# Altium project flexplatV1.1.PrjPCB
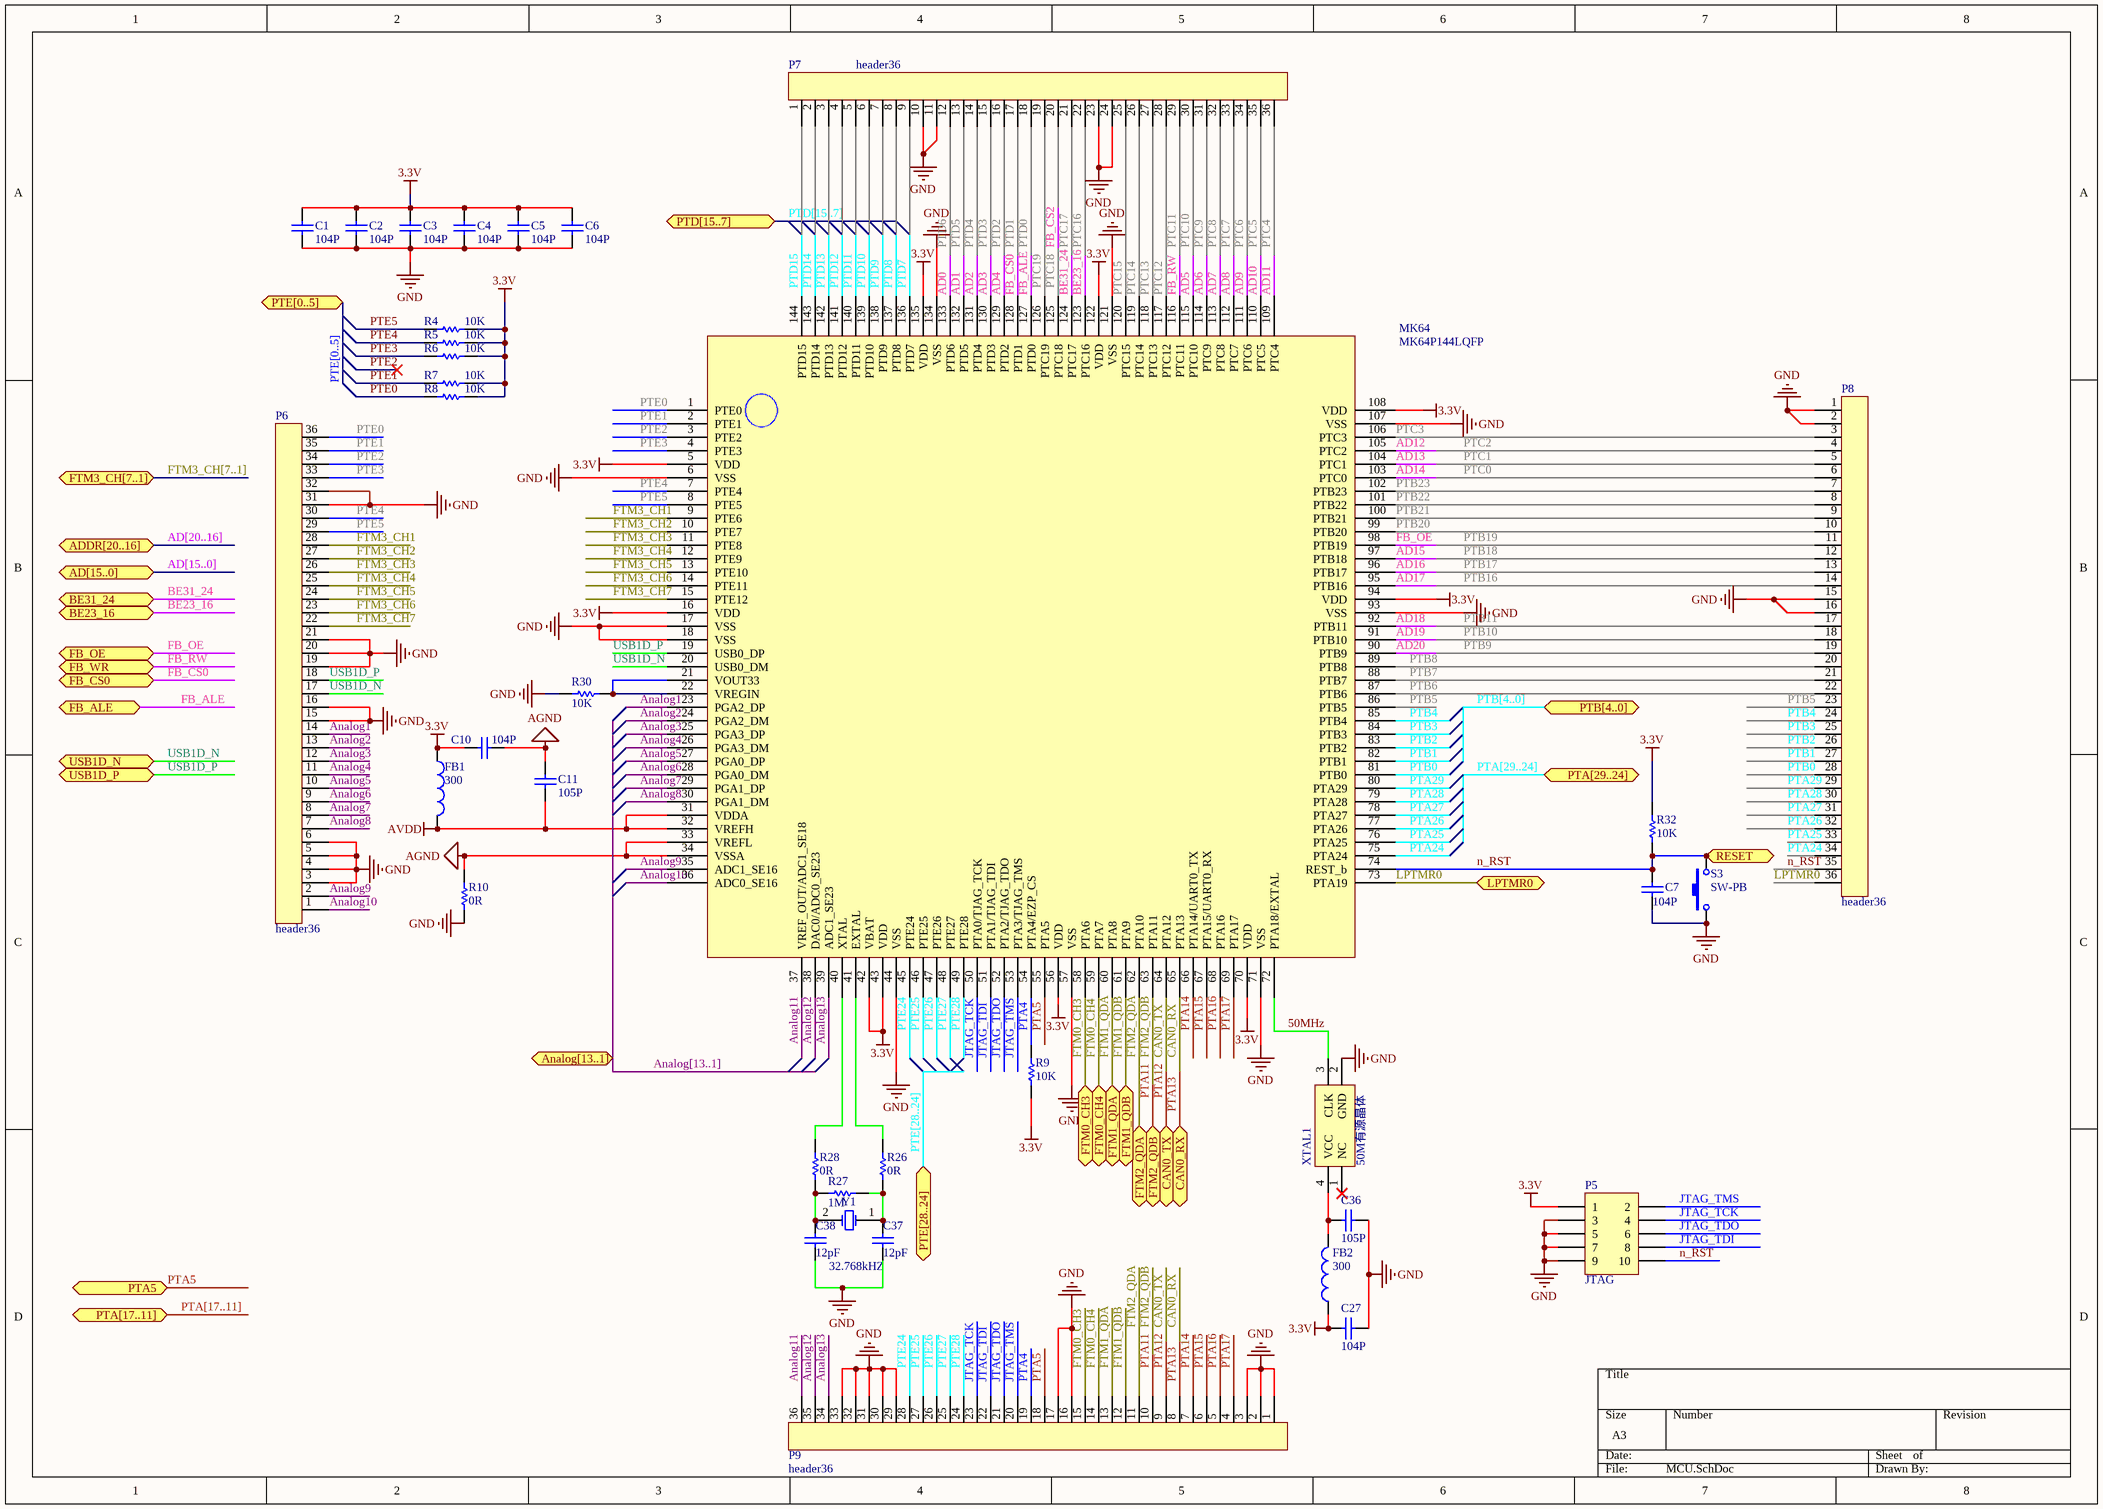
[diagram p0: MCU.SchDoc]
2 sheets, 47 parts. Net scope: flat (ports and power ports of the same name join across sheets).
Board file: FPv1.3.PcbDoc
Sheets:
  MCU.SchDoc
  connect.SchDoc

## Sheet MCU.SchDoc
size A3

### Parts
C1  value 104P  [1608[0603]]  (hidden comment: Cap)
C2  value 104P  [1608[0603]]  (hidden comment: Cap)
C3  value 104P  [1608[0603]]  (hidden comment: Cap)
C4  value 104P  [1608[0603]]  (hidden comment: Cap)
C5  value 104P  [1608[0603]]  (hidden comment: Cap)
C6  value 104P  [1608[0603]]  (hidden comment: Cap)
C7  value 104P  [1608[0603]]  (hidden comment: Cap)
C10  value 104P  [1608[0603]]  (hidden comment: Cap)
C11  value 105P  [1608[0603]]  (hidden comment: Cap)
C27  value 104P  [1608[0603]]  (hidden comment: Cap)
C36  value 105P  [1608[0603]]  (hidden comment: Cap)
C37  value 12pF  [1608[0603]]  (hidden comment: Cap)
C38  value 12pF  [1608[0603]]  (hidden comment: Cap)
FB1  value 300  [1608[0603]]  (hidden comment: Inductor)
FB2  value 300  [1608[0603]]  (hidden comment: Inductor)
MK64  MK64P144LQFP  [LQFP-144]
P5  JTAG  [MHDR2X5]
P6  header36  [FFC/SM0.5-2H36]
P7  header36  [FFC/SM0.5-2H36]
P8  header36  [FFC/SM0.5-2H36]
P9  header36  [FFC/SM0.5-2H36]
R4  value 10K  [1608[0603]]  (hidden comment: Res)
R5  value 10K  [1608[0603]]  (hidden comment: Res)
R6  value 10K  [1608[0603]]  (hidden comment: Res)
R7  value 10K  [1608[0603]]  (hidden comment: Res)
R8  value 10K  [1608[0603]]  (hidden comment: Res)
R9  value 10K  [1608[0603]]  (hidden comment: Res)
R10  value 0R  [1608[0603]]  (hidden comment: Res)
R26  value 0R  [1608[0603]]  (hidden comment: Res)
R27  value 1M  [1608[0603]]  (hidden comment: Res)
R28  value 0R  [1608[0603]]  (hidden comment: Res)
R30  value 10K  [1608[0603]]  (hidden comment: Res)
R32  value 10K  [1608[0603]]  (hidden comment: Res)
S3  SW-PB  [key 3*4*2]
XTAL1  50M有源晶体  [XTAL7_3225]
Y1  32.768kHZ  [3215]

### Ports
AD[15..0], ADDR[20..16], Analog[13..1], BE23_16, BE31_24, CAN0_RX, CAN0_TX, FB_ALE, FB_CS0, FB_OE, FB_WR, FTM0_CH3, FTM0_CH4, FTM1_QDA, FTM1_QDB, FTM2_QDA, FTM2_QDB, FTM3_CH[7..1], LPTMR0, PTA5, PTA[17..11], PTA[29..24], PTB[4..0], PTD[15..7], PTE[0..5], PTE[28..24], RESET, USB1D_N, USB1D_P

### Nets
3.3V: C1.2 C2.2 C3.2 C4.2 C5.2 C6.2 C10.1 C27.2 FB1.1 FB2.1 MK64.5(VDD) MK64.16(VDD) MK64.42(VBAT) MK64.43(VDD) MK64.56(VDD) MK64.70(VDD) MK64.94(VDD) MK64.108(VDD) MK64.122(VDD) MK64.135(VDD) P5.1 R4.1 R5.1 R6.1 R7.1 R8.1 R9.1 R32.1
AGND: C10.2 C11.2 MK64.33(VREFL) MK64.34(VSSA) R10.2
AVDD: C11.1 FB1.2 MK64.31(VDDA) MK64.32(VREFH)
GND: C1.1 C2.1 C3.1 C4.1 C5.1 C6.1 C7.1 C27.1 C36.1 C37.1 C38.1 MK64.6(VSS) MK64.17(VSS) MK64.18(VSS) MK64.44(VSS) MK64.57(VSS) MK64.71(VSS) MK64.93(VSS) MK64.107(VSS) MK64.121(VSS) MK64.134(VSS) P5.3 P5.5 P5.7 P5.9 P6.3 P6.4 P6.5 P6.6 P6.15 P6.16 P6.19 P6.20 P6.21 P6.31 P6.32 P7.10 P7.11 P7.23 P7.24 P8.1 P8.2 P8.15 P8.16 P9.1 P9.2 P9.3 P9.16 P9.17 P9.29 P9.30 P9.31 P9.32 P9.33 R10.1 R30.1 S3.1 XTAL1.2(GND)
50MHz: MK64.72(PTA18/EXTAL) XTAL1.3(CLK)
AD0: MK64.133(PTD6) P7.12  [also labelled PTD6]
AD1: MK64.132(PTD5) P7.13  [also labelled PTD5]
AD2: MK64.131(PTD4) P7.14  [also labelled PTD4]
AD3: MK64.130(PTD3) P7.15  [also labelled PTD3]
AD4: MK64.129(PTD2) P7.16  [also labelled PTD2]
AD5: MK64.115(PTC10) P7.30  [also labelled PTC10]
AD6: MK64.114(PTC9) P7.31  [also labelled PTC9]
AD7: MK64.113(PTC8) P7.32  [also labelled PTC8]
AD8: MK64.112(PTC7) P7.33  [also labelled PTC7]
AD9: MK64.111(PTC6) P7.34  [also labelled PTC6]
AD10: MK64.110(PTC5) P7.35  [also labelled PTC5]
AD11: MK64.109(PTC4) P7.36  [also labelled PTC4]
AD12: MK64.105(PTC2) P8.4  [also labelled PTC2]
AD13: MK64.104(PTC1) P8.5  [also labelled PTC1]
AD14: MK64.103(PTC0) P8.6  [also labelled PTC0]
AD15: MK64.97(PTB18) P8.12  [also labelled PTB18]
AD16: MK64.96(PTB17) P8.13  [also labelled PTB17]
AD17: MK64.95(PTB16) P8.14  [also labelled PTB16]
AD18: MK64.92(PTB11) P8.17  [also labelled PTB11]
AD19: MK64.91(PTB10) P8.18  [also labelled PTB10]
AD20: MK64.90(PTB9) P8.19  [also labelled PTB9]
Analog1: MK64.23(PGA2_DP) P6.14
Analog2: MK64.24(PGA2_DM) P6.13
Analog3: MK64.25(PGA3_DP) P6.12
Analog4: MK64.26(PGA3_DM) P6.11
Analog5: MK64.27(PGA0_DP) P6.10
Analog6: MK64.28(PGA0_DM) P6.9
Analog7: MK64.29(PGA1_DP) P6.8
Analog8: MK64.30(PGA1_DM) P6.7
Analog9: MK64.35(ADC1_SE16) P6.2
Analog10: MK64.36(ADC0_SE16) P6.1
Analog11: MK64.37(VREF_OUT/ADC1_SE18) P9.36
Analog12: MK64.38(DAC0/ADC0_SE23) P9.35
Analog13: MK64.39(ADC1_SE23) P9.34
BE23_16: MK64.123(PTC16) P7.22 ; port BE23_16  [also labelled PTC16]
BE31_24: MK64.124(PTC17) P7.21 ; port BE31_24  [also labelled PTC17]
CAN0_RX: MK64.65(PTA13) P9.8 ; port CAN0_RX  [also labelled PTA13]
CAN0_TX: MK64.64(PTA12) P9.9 ; port CAN0_TX  [also labelled PTA12]
FB_ALE: MK64.127(PTD0) P7.18 ; port FB_ALE  [also labelled PTD0]
FB_CS0: MK64.128(PTD1) P7.17 ; port FB_CS0  [also labelled PTD1]
FB_CS2: MK64.125(PTC18) P7.20  [also labelled PTC18]
FB_OE: MK64.98(PTB19) P8.11 ; port FB_OE  [also labelled PTB19]
FB_RW: MK64.116(PTC11) P7.29 ; port FB_WR  [also labelled PTC11]
FTM0_CH3: MK64.58(PTA6) P9.15 ; port FTM0_CH3
FTM0_CH4: MK64.59(PTA7) P9.14 ; port FTM0_CH4
FTM1_QDA: MK64.60(PTA8) P9.13 ; port FTM1_QDA
FTM1_QDB: MK64.61(PTA9) P9.12 ; port FTM1_QDB
FTM2_QDA: MK64.62(PTA10) P9.11 ; port FTM2_QDA
FTM2_QDB: MK64.63(PTA11) P9.10 ; port FTM2_QDB  [also labelled PTA11]
FTM3_CH1: MK64.9(PTE6) P6.28
FTM3_CH2: MK64.10(PTE7) P6.27
FTM3_CH3: MK64.11(PTE8) P6.26
FTM3_CH4: MK64.12(PTE9) P6.25
FTM3_CH5: MK64.13(PTE10) P6.24
FTM3_CH6: MK64.14(PTE11) P6.23
FTM3_CH7: MK64.15(PTE12) P6.22
JTAG_TCK: MK64.50(PTA0/TJAG_TCK) P5.4 P9.23
JTAG_TDI: MK64.51(PTA1/TJAG_TDI) P5.8 P9.22
JTAG_TDO: MK64.52(PTA2/TJAG_TDO) P5.6 P9.21
JTAG_TMS: MK64.53(PTA3/TJAG_TMS) P5.2 P9.20
LPTMR0: MK64.73(PTA19) P8.36 ; port LPTMR0
n_RST: C7.2 MK64.74(REST_b) P5.10 P8.35 R32.2 S3.2 ; port RESET
PTA4: MK64.54(PTA4/EZP_CS) P9.19 R9.2
PTA5: MK64.55(PTA5) P9.18 ; port PTA5
PTA14: MK64.66(PTA14/UART0_TX) P9.7
PTA15: MK64.67(PTA15/UART0_RX) P9.6
PTA16: MK64.68(PTA16) P9.5
PTA17: MK64.69(PTA17) P9.4
PTA24: MK64.75(PTA24) P8.34
PTA25: MK64.76(PTA25) P8.33
PTA26: MK64.77(PTA26) P8.32
PTA27: MK64.78(PTA27) P8.31
PTA28: MK64.79(PTA28) P8.30
PTA29: MK64.80(PTA29) P8.29
PTB0: MK64.81(PTB0) P8.28
PTB1: MK64.82(PTB1) P8.27
PTB2: MK64.83(PTB2) P8.26
PTB3: MK64.84(PTB3) P8.25
PTB4: MK64.85(PTB4) P8.24
PTB5: MK64.86(PTB5) P8.23
PTB6: MK64.87(PTB6) P8.22
PTB7: MK64.88(PTB7) P8.21
PTB8: MK64.89(PTB8) P8.20
PTB20: MK64.99(PTB20) P8.10
PTB21: MK64.100(PTB21) P8.9
PTB22: MK64.101(PTB22) P8.8
PTB23: MK64.102(PTB23) P8.7
PTC3: MK64.106(PTC3) P8.3
PTC12: MK64.117(PTC12) P7.28
PTC13: MK64.118(PTC13) P7.27
PTC14: MK64.119(PTC14) P7.26
PTC15: MK64.120(PTC15) P7.25
PTC19: MK64.126(PTC19) P7.19
PTD7: MK64.136(PTD7) P7.9
PTD8: MK64.137(PTD8) P7.8
PTD9: MK64.138(PTD9) P7.7
PTD10: MK64.139(PTD10) P7.6
PTD11: MK64.140(PTD11) P7.5
PTD12: MK64.141(PTD12) P7.4
PTD13: MK64.142(PTD13) P7.3
PTD14: MK64.143(PTD14) P7.2
PTD15: MK64.144(PTD15) P7.1
PTE0: MK64.1(PTE0) P6.36 R8.2
PTE1: MK64.2(PTE1) P6.35 R7.2
PTE2: MK64.3(PTE2) P6.34
PTE3: MK64.4(PTE3) P6.33 R6.2
PTE4: MK64.7(PTE4) P6.30 R5.2
PTE5: MK64.8(PTE5) P6.29 R4.2
PTE24: MK64.45(PTE24) P9.28
PTE25: MK64.46(PTE25) P9.27
PTE26: MK64.47(PTE26) P9.26
PTE27: MK64.48(PTE27) P9.25
PTE28: MK64.49(PTE28) P9.24
USB1D_N: MK64.20(USB0_DM) P6.17 ; port USB1D_N
USB1D_P: MK64.19(USB0_DP) P6.18 ; port USB1D_P
NetC36_2: C36.2 FB2.2 XTAL1.4(VCC)
NetC37_2: C37.2 R26.1 R27.1 Y1.1(OSC1)
NetC38_2: C38.2 R27.2 R28.1 Y1.2(OSC2)
NetMK64_21: MK64.21(VOUT33) MK64.22(VREGIN) R30.2
NetMK64_40: MK64.40(XTAL) R28.2
NetMK64_41: MK64.41(EXTAL) R26.2

Not connected (* = marked no-connect by the designer): XTAL1 1(NC)*

### Buses and harness runs
bus AD[15..0] = port AD[15..0]
bus AD[20..16] = port ADDR[20..16]
bus Analog[13..1] = port Analog[13..1]
bus FTM3_CH[7..1] = port FTM3_CH[7..1]
bus PTA[17..11] = port PTA[17..11]
bus PTA[29..24] = port PTA[29..24]
bus PTB[4..0] = port PTB[4..0]
bus PTD[15..7] = port PTD[15..7]
bus PTE[0..5] = port PTE[0..5]
bus PTE[28..24] = port PTE[28..24]

### Library data of the parts
C1-C7 C10 C11 C27 C36-C38 = Cap: 贴片电容; Published: 8-Jun-2000; LatestRevisionDate: 17-Jul-2002; LatestRevisionNote: Re-released for DXP Platform.; PackageReference: RAD-0.3; Publisher: Altium Limited
FB1 FB2 = Inductor: Code_IEC: 1005; Published: 8-Jun-2000; LatestRevisionDate: 29-May-2009; LatestRevisionNote: IPC-7351 Footprint Added.; PackageReference: 0402-A; Publisher: Altium Limited; PackageDescription: Chip Inductor; Code_JEITA: 0402
P5 = Header 5X2: Header, 5-Pin, Dual row; LatestRevisionDate: 17-Jul-2002; LatestRevisionNote: Re-released for DXP Platform.; Publisher: Altium Limited
R4-R10 R26-R28 R30 R32 = Res: 贴片电阻; Published: 8-Jun-2000; LatestRevisionDate: 17-Jul-2002; LatestRevisionNote: Re-released for DXP Platform.; PackageReference: AXIAL-0.3; Publisher: Altium Limited
S3 = SW-PB: Switch
XTAL1 = 有源晶体
Y1 = XTAL: 晶体振荡器; Published: 8-Jun-2000; LatestRevisionDate: 17-Jul-2002; LatestRevisionNote: Re-released for DXP Platform.; PackageReference: R38; Publisher: Altium Limited

## Sheet connect.SchDoc
size A4
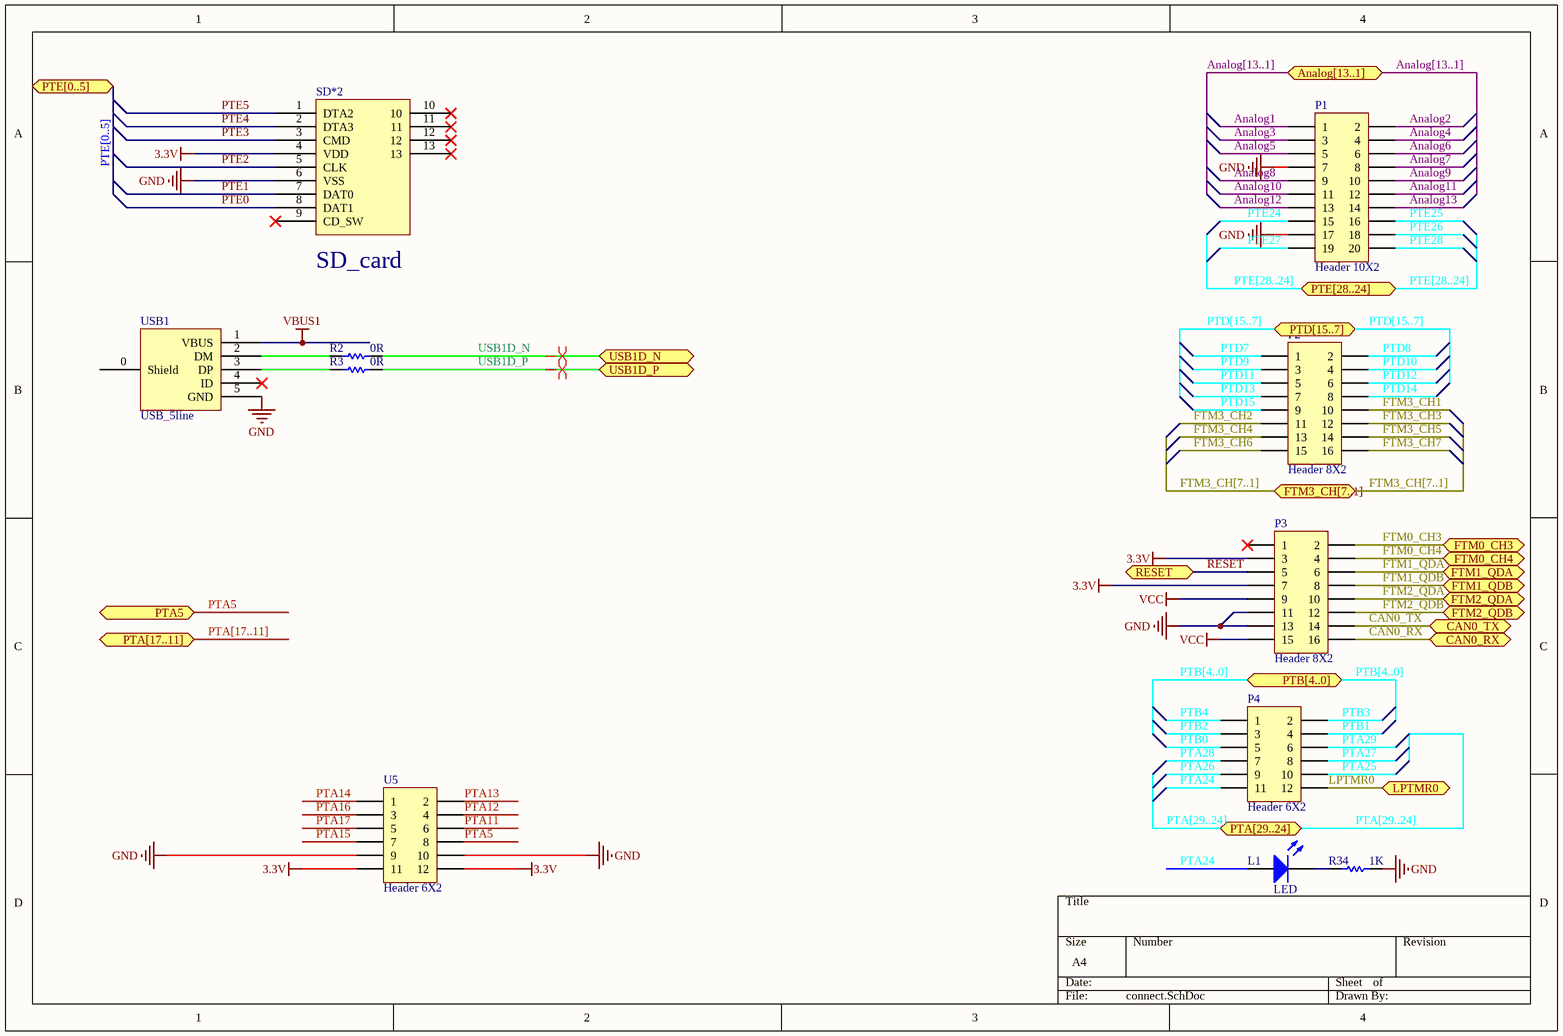
[diagram p1: connect.SchDoc]

### Parts
L1  LED  [1608[0603]]
P1  Header 10X2  [HDR2X10]
P2  Header 8X2  [HDR2X8]
P3  Header 8X2  [HDR2X8]
P4  Header 6X2  [HDR2X6]
R2  value 0R  [1608[0603]]  (hidden comment: Res)
R3  value 0R  [1608[0603]]  (hidden comment: Res)
R34  value 1K  [1608[0603]]  (hidden comment: Res)
SD*2  TF_card  [TF卡座(短体)]  (value not drawn)
U5  Header 6X2  [HDR2X6]
USB1  USB_5line  [USB-MICRO-5P-2F]

### Ports
Analog[13..1], CAN0_RX, CAN0_TX, FTM0_CH3, FTM0_CH4, FTM1_QDA, FTM1_QDB, FTM2_QDA, FTM2_QDB, FTM3_CH[7..1], LPTMR0, PTA5, PTA[17..11], PTA[29..24], PTB[4..0], PTD[15..7], PTE[0..5], PTE[28..24], RESET, USB1D_N, USB1D_P

### Nets
3.3V: P3.3 P3.7 SD*2.4(VDD) U5.11 U5.12
GND: P1.7 P1.17 P3.11 P3.13 R34.1 SD*2.6(VSS) U5.9 U5.10 USB1.5(GND)
VBUS1: USB1.1(VBUS)
VCC: P3.9 P3.15
Analog1: P1.1
Analog2: P1.2
Analog3: P1.3
Analog4: P1.4
Analog5: P1.5
Analog6: P1.6
Analog7: P1.8
Analog8: P1.9
Analog9: P1.10
Analog10: P1.11
Analog11: P1.12
Analog12: P1.13
Analog13: P1.14
CAN0_RX: P3.16 U5.2 ; port CAN0_RX  [also labelled PTA13]
CAN0_TX: P3.14 U5.4 ; port CAN0_TX  [also labelled PTA12]
FTM0_CH3: P3.2 ; port FTM0_CH3
FTM0_CH4: P3.4 ; port FTM0_CH4
FTM1_QDA: P3.6 ; port FTM1_QDA
FTM1_QDB: P3.8 ; port FTM1_QDB
FTM2_QDA: P3.10 ; port FTM2_QDA
FTM2_QDB: P3.12 U5.6 ; port FTM2_QDB  [also labelled PTA11]
FTM3_CH1: P2.10
FTM3_CH2: P2.11
FTM3_CH3: P2.12
FTM3_CH4: P2.13
FTM3_CH5: P2.14
FTM3_CH6: P2.15
FTM3_CH7: P2.16
LPTMR0: P4.12 ; port LPTMR0
PTA5: U5.8 ; port PTA5
PTA14: U5.1
PTA15: U5.7
PTA16: U5.3
PTA17: U5.5
PTA24: L1.1(A) P4.11
PTA25: P4.10
PTA26: P4.9
PTA27: P4.8
PTA28: P4.7
PTA29: P4.6
PTB0: P4.5
PTB1: P4.4
PTB2: P4.3
PTB3: P4.2
PTB4: P4.1
PTD7: P2.1
PTD8: P2.2
PTD9: P2.3
PTD10: P2.4
PTD11: P2.5
PTD12: P2.6
PTD13: P2.7
PTD14: P2.8
PTD15: P2.9
PTE0: SD*2.8(DAT1)
PTE1: SD*2.7(DAT0)
PTE2: SD*2.5(CLK)
PTE3: SD*2.3(CMD)
PTE4: SD*2.2(DTA3)
PTE5: SD*2.1(DTA2)
PTE24: P1.15
PTE25: P1.16
PTE26: P1.18
PTE27: P1.19
PTE28: P1.20
RESET: P3.5 ; port RESET  [project net n_RST]
USB1D_N: R2.1 ; port USB1D_N
USB1D_P: R3.1 ; port USB1D_P
NetL1_2: L1.2(K) R34.2
NetR2_2: R2.2 USB1.2(DM)
NetR3_2: R3.2 USB1.3(DP)

Not connected (* = marked no-connect by the designer): P3 1*; SD*2 9(CD_SW)* 10* 11* 12* 13*; USB1 0(Shield) 4(ID)*

### Buses and harness runs
bus Analog[13..1] = port Analog[13..1]
bus FTM3_CH[7..1] = port FTM3_CH[7..1]
bus PTA[17..11] = port PTA[17..11]
bus PTA[29..24] = port PTA[29..24]
bus PTB[4..0] = port PTB[4..0]
bus PTD[15..7] = port PTD[15..7]
bus PTE[0..5] = port PTE[0..5]
bus PTE[28..24] = port PTE[28..24]

### Layout directives
differential pair: USB1D_N, USB1D_P

### Notes on the sheet
- (in symbol TF_card) SD_card

### Library data of the parts
P1 = Header 10X2: Header, 10-Pin, Dual row; LatestRevisionDate: 17-Jul-2002; LatestRevisionNote: Re-released for DXP Platform.; Publisher: Altium Limited
P2 P3 = Header 8X2: Header, 8-Pin, Dual row; LatestRevisionDate: 17-Jul-2002; LatestRevisionNote: Re-released for DXP Platform.; Publisher: Altium Limited
P4 U5 = Header 6X2: Header, 6-Pin, Dual row; LatestRevisionDate: 17-Jul-2002; LatestRevisionNote: Re-released for DXP Platform.; Publisher: Altium Limited
R2 R3 R34 = Res: 贴片电阻; Published: 8-Jun-2000; LatestRevisionDate: 17-Jul-2002; LatestRevisionNote: Re-released for DXP Platform.; PackageReference: AXIAL-0.3; Publisher: Altium Limited

## Nets that join several sheets
3.3V: MCU (28 pins), connect (5 pins)
GND: MCU (58 pins), connect (9 pins)
Analog1: MCU (MK64.23 P6.14), connect (P1.1)
Analog2: MCU (MK64.24 P6.13), connect (P1.2)
Analog3: MCU (MK64.25 P6.12), connect (P1.3)
Analog4: MCU (MK64.26 P6.11), connect (P1.4)
Analog5: MCU (MK64.27 P6.10), connect (P1.5)
Analog6: MCU (MK64.28 P6.9), connect (P1.6)
Analog7: MCU (MK64.29 P6.8), connect (P1.8)
Analog8: MCU (MK64.30 P6.7), connect (P1.9)
Analog9: MCU (MK64.35 P6.2), connect (P1.10)
Analog10: MCU (MK64.36 P6.1), connect (P1.11)
Analog11: MCU (MK64.37 P9.36), connect (P1.12)
Analog12: MCU (MK64.38 P9.35), connect (P1.13)
Analog13: MCU (MK64.39 P9.34), connect (P1.14)
CAN0_RX: MCU (MK64.65 P9.8), connect (P3.16 U5.2)
CAN0_TX: MCU (MK64.64 P9.9), connect (P3.14 U5.4)
FTM0_CH3: MCU (MK64.58 P9.15), connect (P3.2)
FTM0_CH4: MCU (MK64.59 P9.14), connect (P3.4)
FTM1_QDA: MCU (MK64.60 P9.13), connect (P3.6)
FTM1_QDB: MCU (MK64.61 P9.12), connect (P3.8)
FTM2_QDA: MCU (MK64.62 P9.11), connect (P3.10)
FTM2_QDB: MCU (MK64.63 P9.10), connect (P3.12 U5.6)
FTM3_CH1: MCU (MK64.9 P6.28), connect (P2.10)
FTM3_CH2: MCU (MK64.10 P6.27), connect (P2.11)
FTM3_CH3: MCU (MK64.11 P6.26), connect (P2.12)
FTM3_CH4: MCU (MK64.12 P6.25), connect (P2.13)
FTM3_CH5: MCU (MK64.13 P6.24), connect (P2.14)
FTM3_CH6: MCU (MK64.14 P6.23), connect (P2.15)
FTM3_CH7: MCU (MK64.15 P6.22), connect (P2.16)
LPTMR0: MCU (MK64.73 P8.36), connect (P4.12)
n_RST: MCU (6 pins), connect (P3.5)
PTA5: MCU (MK64.55 P9.18), connect (U5.8)
PTA14: MCU (MK64.66 P9.7), connect (U5.1)
PTA15: MCU (MK64.67 P9.6), connect (U5.7)
PTA16: MCU (MK64.68 P9.5), connect (U5.3)
PTA17: MCU (MK64.69 P9.4), connect (U5.5)
PTA24: MCU (MK64.75 P8.34), connect (L1.1 P4.11)
PTA25: MCU (MK64.76 P8.33), connect (P4.10)
PTA26: MCU (MK64.77 P8.32), connect (P4.9)
PTA27: MCU (MK64.78 P8.31), connect (P4.8)
PTA28: MCU (MK64.79 P8.30), connect (P4.7)
PTA29: MCU (MK64.80 P8.29), connect (P4.6)
PTB0: MCU (MK64.81 P8.28), connect (P4.5)
PTB1: MCU (MK64.82 P8.27), connect (P4.4)
PTB2: MCU (MK64.83 P8.26), connect (P4.3)
PTB3: MCU (MK64.84 P8.25), connect (P4.2)
PTB4: MCU (MK64.85 P8.24), connect (P4.1)
PTD7: MCU (MK64.136 P7.9), connect (P2.1)
PTD8: MCU (MK64.137 P7.8), connect (P2.2)
PTD9: MCU (MK64.138 P7.7), connect (P2.3)
PTD10: MCU (MK64.139 P7.6), connect (P2.4)
PTD11: MCU (MK64.140 P7.5), connect (P2.5)
PTD12: MCU (MK64.141 P7.4), connect (P2.6)
PTD13: MCU (MK64.142 P7.3), connect (P2.7)
PTD14: MCU (MK64.143 P7.2), connect (P2.8)
PTD15: MCU (MK64.144 P7.1), connect (P2.9)
PTE0: MCU (MK64.1 P6.36 R8.2), connect (SD*2.8)
PTE1: MCU (MK64.2 P6.35 R7.2), connect (SD*2.7)
PTE2: MCU (MK64.3 P6.34), connect (SD*2.5)
PTE3: MCU (MK64.4 P6.33 R6.2), connect (SD*2.3)
PTE4: MCU (MK64.7 P6.30 R5.2), connect (SD*2.2)
PTE5: MCU (MK64.8 P6.29 R4.2), connect (SD*2.1)
PTE24: MCU (MK64.45 P9.28), connect (P1.15)
PTE25: MCU (MK64.46 P9.27), connect (P1.16)
PTE26: MCU (MK64.47 P9.26), connect (P1.18)
PTE27: MCU (MK64.48 P9.25), connect (P1.19)
PTE28: MCU (MK64.49 P9.24), connect (P1.20)
USB1D_N: MCU (MK64.20 P6.17), connect (R2.1)
USB1D_P: MCU (MK64.19 P6.18), connect (R3.1)